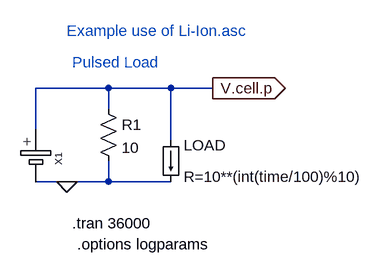
[diagram p0: schematic Li-Ion-Example.asc]
Li-Ion-Example.asc, the LTspice schematic file:
Version 4.1
SHEET 1 2668 680
WIRE 288 64 176 64
WIRE 384 64 288 64
WIRE 448 64 384 64
WIRE 288 96 288 64
WIRE 176 128 176 64
WIRE 384 144 384 64
WIRE 224 208 176 208
WIRE 288 208 288 176
WIRE 288 208 224 208
WIRE 384 208 288 208
FLAG 224 208 0
FLAG 448 64 V.cell.p
IOPIN 448 64 Out
SYMBOL res 272 80 R0
SYMATTR InstName R1
SYMATTR Value 10
SYMBOL Li-Ion 48 176 R0
SYMATTR InstName X1
SYMATTR Description Lithium-In Battery
SYMBOL load 368 144 R0
SYMATTR InstName LOAD
SYMATTR Value R=10**(int(time/100)%10)
SYMATTR Prefix B
TEXT 232 272 Left 2 !.tran 36000
TEXT 232 24 Left 2 ;Pulsed Load
TEXT 224 -24 Left 2 ;Example use of Li-Ion.asc
TEXT 240 304 Left 2 !.options logparams

The netlist it stands for:
* Li-Ion-Example.asc
R1 V.cell.p 0 10
X§X1 V.cell.p 0 Li-Ion  ; pins cell+ cell-
B§LOAD V.cell.p 0 R=10**(int(time/100)%10)
.tran 36000
* Pulsed Load
* Example use of Li-Ion.asc
.options logparams
.backanno
.end